# Altium schematic sheet programmer_charger.SchDoc: Opo8001
size Letter; Author: William W. Huang; Organization: Altium Limited; Address1: L3, 12a Rodborough Rd; Address2: Frenchs Forest; Address3: NSW; Address4: Australia 2086; Revision: 2
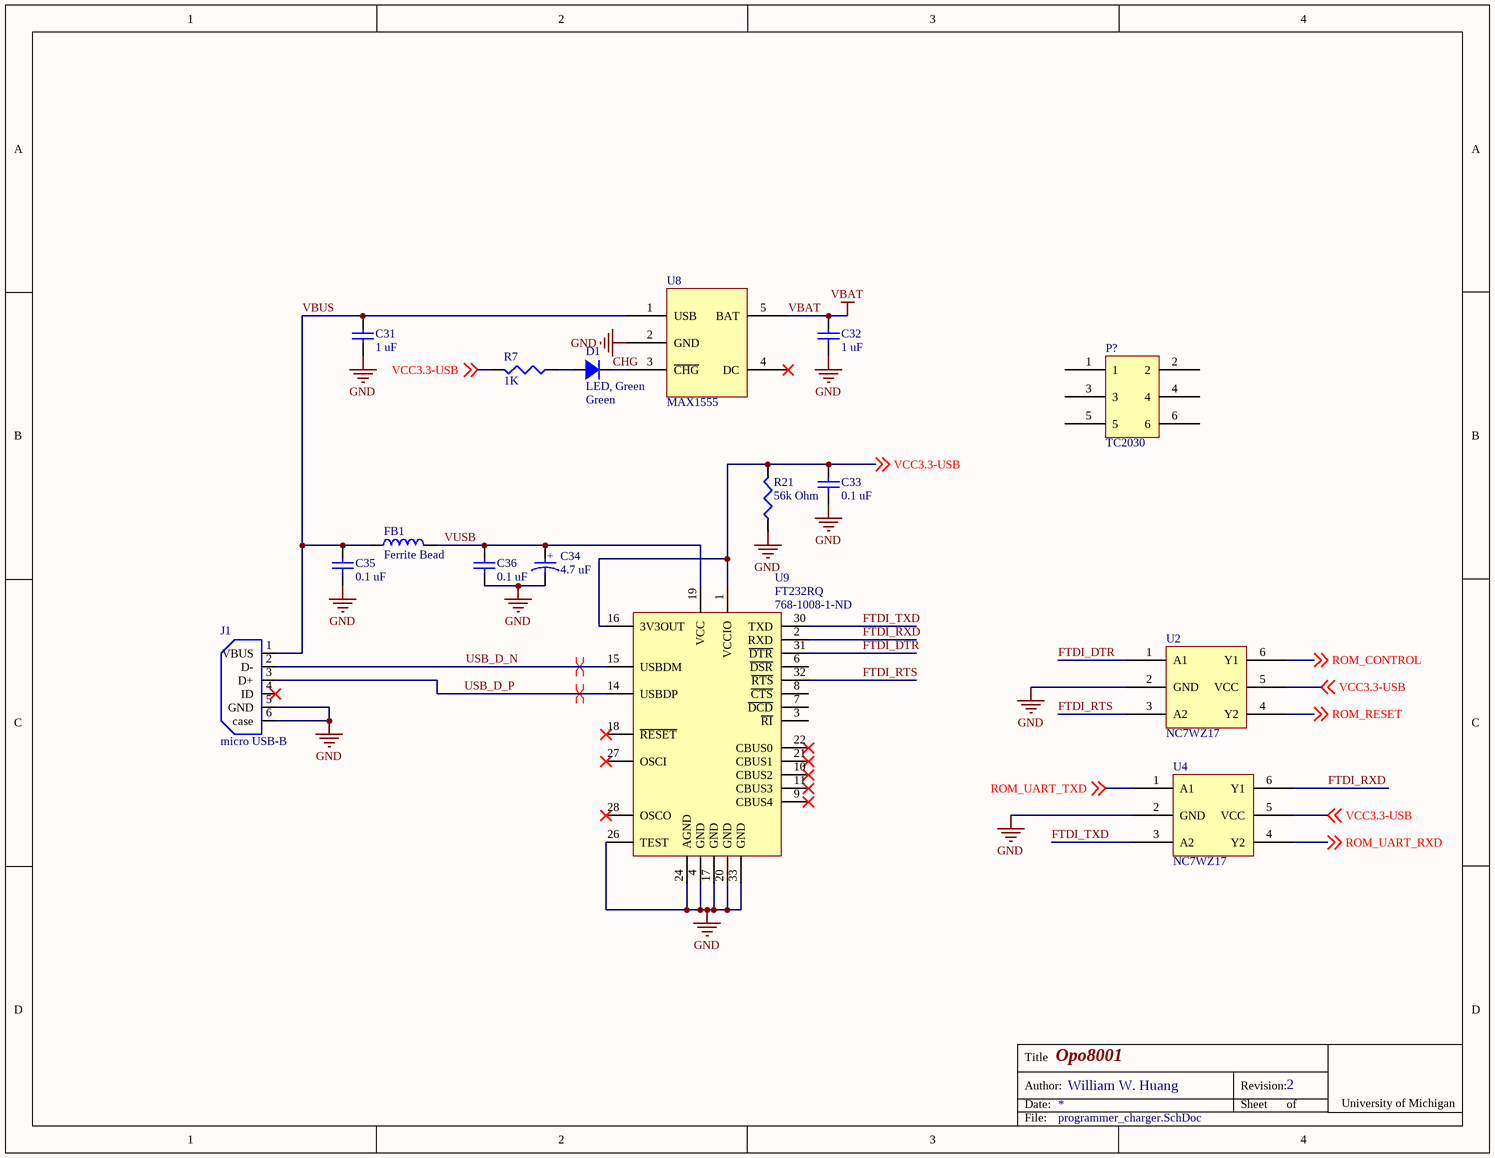
[diagram p0: programmer_charger.SchDoc]

## Parts
C31  value 1 uF  [0402]  (hidden comment: Ceramic capacitor)
C32  value 1 uF  [0402]  (hidden comment: Ceramic capacitor)
C33  value 0.1 uF  [0402]  (hidden comment: Ceramic capacitor)
C34  value 4.7 uF  [0402]  (hidden comment: Tantalum capacitor)
C35  value 0.1 uF  [0402]  (hidden comment: Ceramic capacitor)
C36  value 0.1 uF  [0402]  (hidden comment: Ceramic capacitor)
D1  LED, Green  Color: Green  [0402 - DIODE]
FB1  Ferrite Bead  [0402]
J1  micro USB-B  [Micro USB-B]
P?  TC2030  [TC2030-IDC-NLFP]
R7  value 1K  [0402]  (hidden comment: Chip resistor)
R21  value 56k Ohm  [0402]  (hidden comment: 56k 0402 Res)
U2  NC7WZ17  [SC-70-6]
U4  NC7WZ17  [SC-70-6]
U8  MAX1555  [SOT23-5]
U9  FT232RQ  Supplier Part Number 1: 768-1008-1-ND  [QFN-32]

## Nets
GND: C31.2 C32.2 C33.2 C34.2 C35.2 C36.2 J1.5(GND) J1.6(case) R21.2 U2.2(GND) U4.2(GND) U8.2(GND) U9.4(GND) U9.17(GND) U9.20(GND) U9.24(AGND) U9.26(TEST) U9.33(GND)
VBAT: C32.1 U8.5(BAT)
CHG: D1.2 U8.3(~{CHG})
FTDI_DTR: U2.1(A1) U9.31(~{DTR})
FTDI_RTS: U2.3(A2) U9.32(~{RTS})
FTDI_RXD: U4.6(Y1) U9.2(RXD)
FTDI_TXD: U4.3(A2) U9.30(TXD)
ROM_CONTROL: U2.6(Y1) ; off-sheet ROM_CONTROL
ROM_RESET: U2.4(Y2) ; off-sheet ROM_RESET
ROM_UART_RXD: U4.4(Y2) ; off-sheet ROM_UART_RXD
ROM_UART_TXD: U4.1(A1) ; off-sheet ROM_UART_TXD
USB_D_N: J1.2(D-) U9.15(USBDM)
USB_D_P: J1.3(D+) U9.14(USBDP)
VBUS: C31.1 C35.1 FB1.2 J1.1(VBUS) U8.1(USB)
VCC3.3-USB: C33.1 R7.1 R21.1 U2.5(VCC) U4.5(VCC) U9.1(VCCIO) U9.16(3V3OUT) ; off-sheet VCC3.3-USB
VUSB: C34.1 C36.1 FB1.1 U9.19(VCC)
NetD1_1: D1.1 R7.2

Not connected (* = marked no-connect by the designer): J1 4(ID)*; P? 1 2 3 4 5 6; U8 4(DC)*; U9 3(~{RI}) 6(~{DSR}) 7(~{DCD}) 8(~{CTS}) 9(CBUS4)* 10(CBUS2)* 11(CBUS3)* 18(~{RESET})* 21(CBUS1)* 22(CBUS0)* 27(OSCI)* 28(OSCO)*

## Layout directives
differential pair: USB_D_N, USB_D_P

## Notes on the sheet
- Title
- Date:
- Author:
- Revision:
- Sheet
- of
- University of Michigan
- File:
- (in symbol C_4.7u_0402_tantalum) +

## Library data of the parts
C31 C32 = C_1u_0402_ceramic: Ceramic capacitor, 1 uF, 0402 package; Manufacture: TDK; voltage rated: 6.3 V; tolerance: 10%; package: 0402; Supplier 1: Digi-Key; Supplier Part Number 1: 445-5000-1-ND
C33 C35 C36 = C_0.1u_0402_ceramic: Ceramic capacitor, 0.1u, 0402 package; Manufacture: TDK; voltage rated: 10 V; tolerance: 10%; Supplier 1: Digi-Key; Supplier Part Number 1: 445-1265-1-ND; package: 0402
C34 = C_4.7u_0402_tantalum: Tantalum capacitor, 4.7 uF, 0402 package; Manufacture: AVX; voltage rated: 10 V; tolerance: 20%; package: 0402; Supplier 1: Digi-Key; Supplier Part Number 1: 478-9392-1-ND
D1 = D_LED_GREEN_0402: LED, Green,  0402; package: 0402; Supplier 1: Digi-Key; Supplier Part Number 1: 511-1592-1-ND
FB1 = FB_150mA_0402: Ferrite Bead, 150 mA, 0402 package; impedance@Freq: 1K@100 MHz; current rating: 150 mA; Supplier 1: Digi-Key; Supplier Part Number 1: 587-1835-1-ND; package: 0402
J1 = Micro USB: CONN USB MICRO B RECPT SMT R/A; Supplier 1: Digi-Key; Supplier Part Number 1: 609-4616-6-ND
P? = TC2030: TC2030-MCP-NL
R7 = R_1K_0402: Chip resistor, 1K, 0402 package; tolerance: 1%; power: 1/16 W; Supplier 1: Digi-Key; Supplier Part Number 1: 541-1.00KLCT-ND; package: 0402
R21 = R_56K_0402: 56 kOhm, 1%, .0603 W, 0402; Mfr: Rohm; Mfr Part Number: MCR01MRTF5602; Supplier 1: Digikey; Supplier Part Number 1: RHM56.0KCDCT-ND
U2 U4 = NC7WZ17: UHS Dual Buffer with Schmitt Trigger Inputs; Supplier 1: Digi-Key; Supplier Part Number 1: NC7WZ17P6XCT-ND
U8 = MAX1555: 3 Dual-Input USB/AC Adapter 1-Cell Li+  Battery Chargers; Supplier 1: Digi-Key; Supplier Part Number 1: MAX1555EZK+TTR-ND
U9 = IC_FT232RQ: FT232R USB UART; Manufacturer: *; Note: *; ManufacturerPartNo: *; Supplier 1: Digi-Key